# EasyEDA schematic SCH_semi-automatic-healing-reminder_2026-03-12.json
TITLE: M-CURED; REV: 1.0; Date: 2026-02-15; Sheet: 1/1; Drawn By: -; Company: TEKNIK MESIN
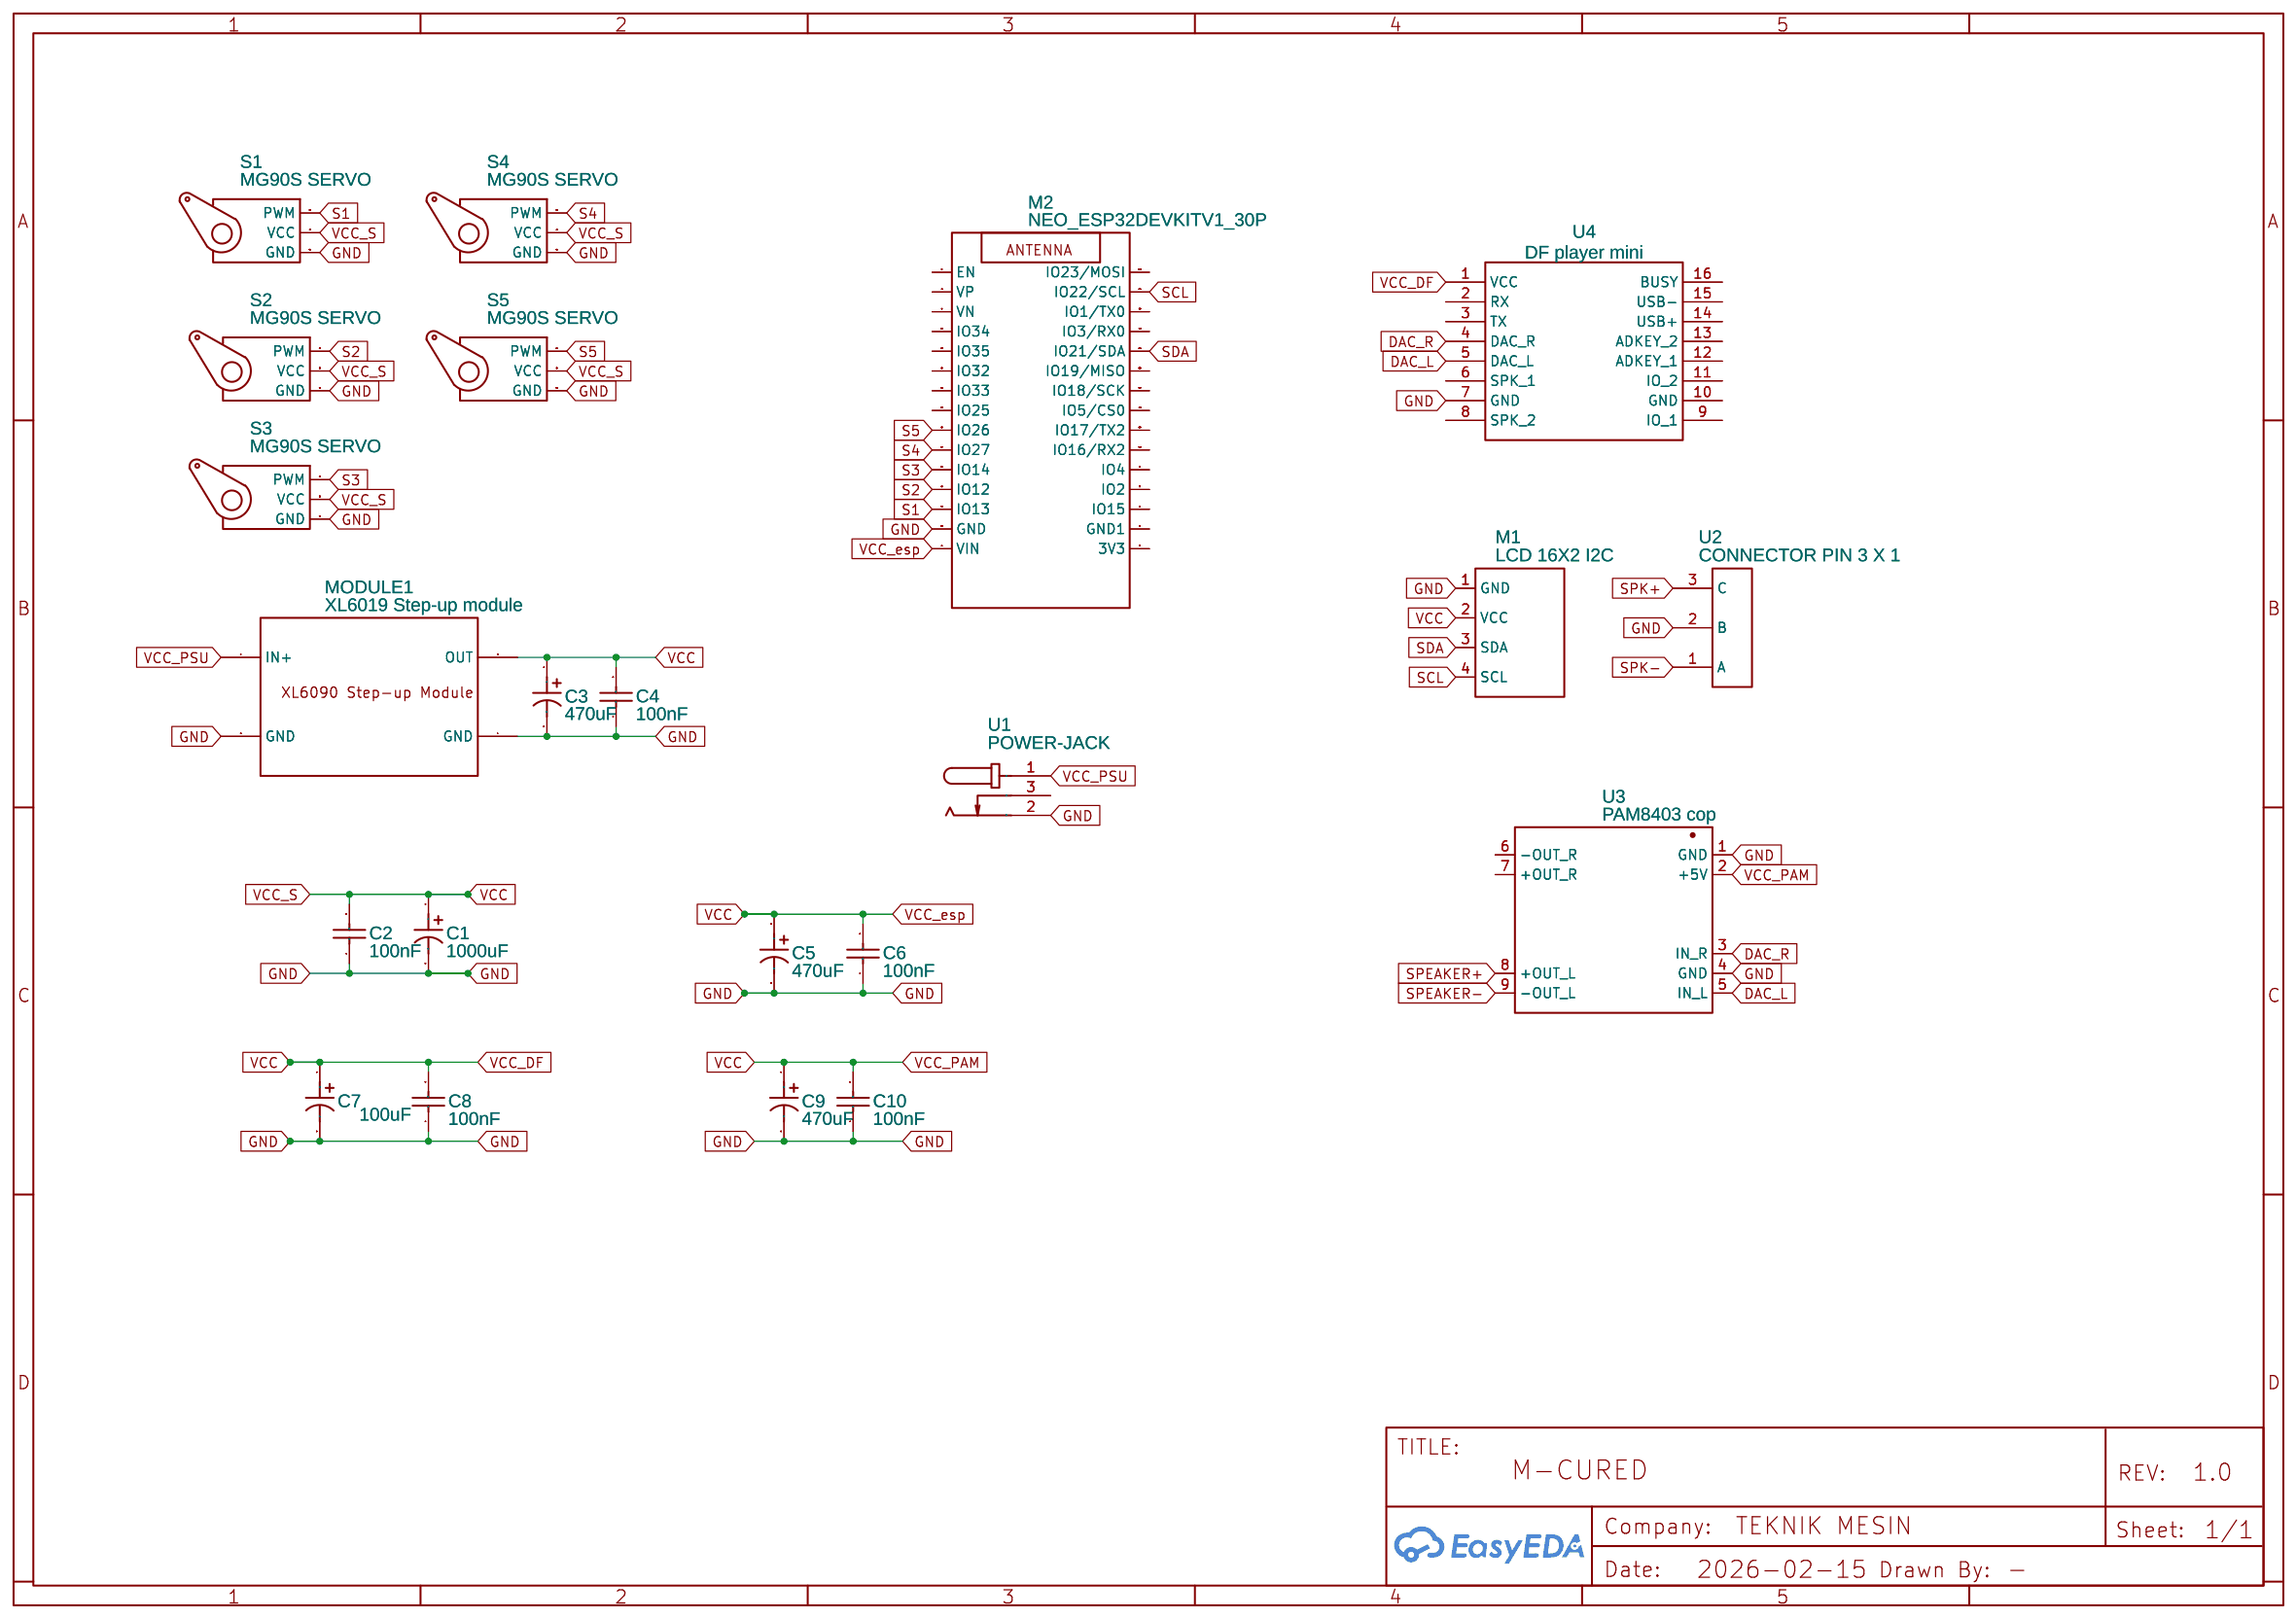
[diagram p0: schematic sheet]

## Parts
C1  1000uF  [CAP-TH_BD8.0-P3.50-D0.5_1000UF10V8X14GF]
C2  100nF  [100NF]
C3  470uF  [CAP-TH_BD8.0-P3.50-D0.5-FD_470UF25VF140KM]
C4  100nF  [100NF]
C5  470uF  [CAP-TH_BD8.0-P3.50-D0.5-FD_470UF25VF140KM]
C6  100nF  [100NF]
C7  100uF  [CAP-TH_BD6.3-P2.50-D0.5-FD-100UF25V6.3X11KM]
C8  100nF  [100NF]
C9  470uF  [CAP-TH_BD8.0-P3.50-D0.5-FD_470UF25VF140KM]
C10  100nF  [100NF]
M1  LCD 16X2 I2C  [LCD-TH_LCD-1602-2X16-BLUE-WHITE]
M2  NEO_ESP32DEVKITV1_30P  [ESP32DEVKITV1_30P_FP]
MODULE1  XL6019 Step-up module  [STEPUP-XL6019E1]
S1  MG90S SERVO  [MG90S SERVO ADAL]
S2  MG90S SERVO  [MG90S SERVO ADAL]
S3  MG90S SERVO  [MG90S SERVO ADAL]
S4  MG90S SERVO  [MG90S SERVO ADAL]
S5  MG90S SERVO  [MG90S SERVO ADAL]
U1  POWER-JACK  [DC-IN-TH_POWER-JACK]
U2  CONNECTOR PIN 3 X 1  [CONNECTOR-PIN-3X1]
U3  PAM8403 cop  [PAM8403]
U4  DF player mini  [DFPLAYER MINI MP3 PLAYER MODULE]

## Library data of the parts
C1 = 1000UF10V8X14GF: Supplier: LCSC; Supplier Part: C49332862; Manufacturer: Econd(米朗电子); Manufacturer Part: 1000uF10V8x14GF; JLCPCB Part Class: Extended Part; Contributor: lcsc
C2 C4 C6 C8 C10 = 100nF: Voltage: 100V; Tolerance: ±20%; EasyEDA: E72322; Supplier Part: C72322; Supplier: LCSC; Manufacturer: ReliaPro; Manufacturer Part: 100nF (104) ±20% 100V; Contributor: Ryan Langemeier
C3 C5 C9 = 470UF25VF140KM: Supplier: LCSC; Supplier Part: C46867098; Manufacturer: Econd(米朗电子); Contributor: lcsc
C7 = 100UF25V6.3X11KM: Supplier: LCSC; Supplier Part: C49304911; Manufacturer: Econd(米朗电子); Manufacturer Part: 100uF25V6.3x11KM; JLCPCB Part Class: Extended Part; Contributor: lcsc
M1 = LCD 16X2 I2C: Contributor: edixtron.solutions
M2 = NEO_ESP32DEVKITV1_30P: Contributor: Ajik
MODULE1 = XL6019 Step-up module: Contributor: Ashwin Abhang
S1-S5 = MG90S SERVO: Contributor: aakashagrawal1805
U1 = POWER-JACK: Contributor: LCSC; Supplier: LCSC; Supplier Part: C9900001795; Manufacturer: 索峰; JLCPCB Part Class: Extended Part
U2 = CONNECTOR PIN 3 X 1: Contributor: leandrobnsilva
U3 = PAM8403 cop: Supplier Part: C17337; Supplier: LCSC; Manufacturer: DIODES; Manufacturer Part: PAM8403DR; Contributor: Destora
U4 = DF player mini: Contributor: Circuit Master; sourceId: cKDVP7pjB

## Nets
GND: C1.2 C2.1 C3.2 C4.1 C5.2 C6.1 C7.2 C8.1 C9.2 C10.1 M1.1(GND) M2.GND MODULE1.2(GND) MODULE1.4(GND) S1.GND S2.GND S3.GND S4.GND S5.GND U1.2 U2.2(B) U3.1(GND) U3.4(GND) U4.7(GND)
VCC: C1.1 C2.2 C3.1 C4.2 C5.1 C6.2 C7.1 C8.2 C9.1 C10.2 M1.2(VCC) M2.VIN MODULE1.3(OUT) S1.VCC S2.VCC S3.VCC S4.VCC S5.VCC U3.2(+5V) U4.1(VCC)
VCC_PSU: MODULE1.1(IN+) U1.1
DAC_L: U3.5(IN L) U4.5(DAC_L)
DAC_R: U3.3(IN R) U4.4(DAC_R)
S1: M2.IO13 S1.PWM
S2: M2.IO12 S2.PWM
S3: M2.IO14 S3.PWM
S4: M2.IO27 S4.PWM
S5: M2.IO26 S5.PWM
SCL: M1.4(SCL) M2.IO22/SCL
SDA: M1.3(SDA) M2.IO21/SDA
SPEAKER+: U3.8(+OUT_L)
SPEAKER-: U3.9(-OUT_L)
SPK+: U2.3(C)
SPK-: U2.1(A)

Not connected (* = marked no-connect by the designer): M2 3V3 EN GND1 IO1/TX0 IO2 IO3/RX0 IO4 IO5/CS0 IO15 IO16/RX2 IO17/TX2 IO18/SCK IO19/MISO IO23/MOSI IO25 IO32 IO33 IO34 IO35 VN VP; U1 3; U3 6(-OUT_R) 7(+OUT_R); U4 2(RX) 3(TX) 6(SPK_1) 8(SPK_2) 9(IO_1) 10(GND) 11(IO_2) 12(ADKEY_1) 13(ADKEY_2) 14(USB+) 15(USB-) 16(BUSY)
